# Altium schematic sheet ProtoAccélérotronLLLetMAS_Circuit.SchDoc
size Tabloid; Date: Date; Author: Author 1; Revision: 1; SheetNumber: 3; SheetTotal: 3; Size: 11x17; Sheet_Name: Circuit
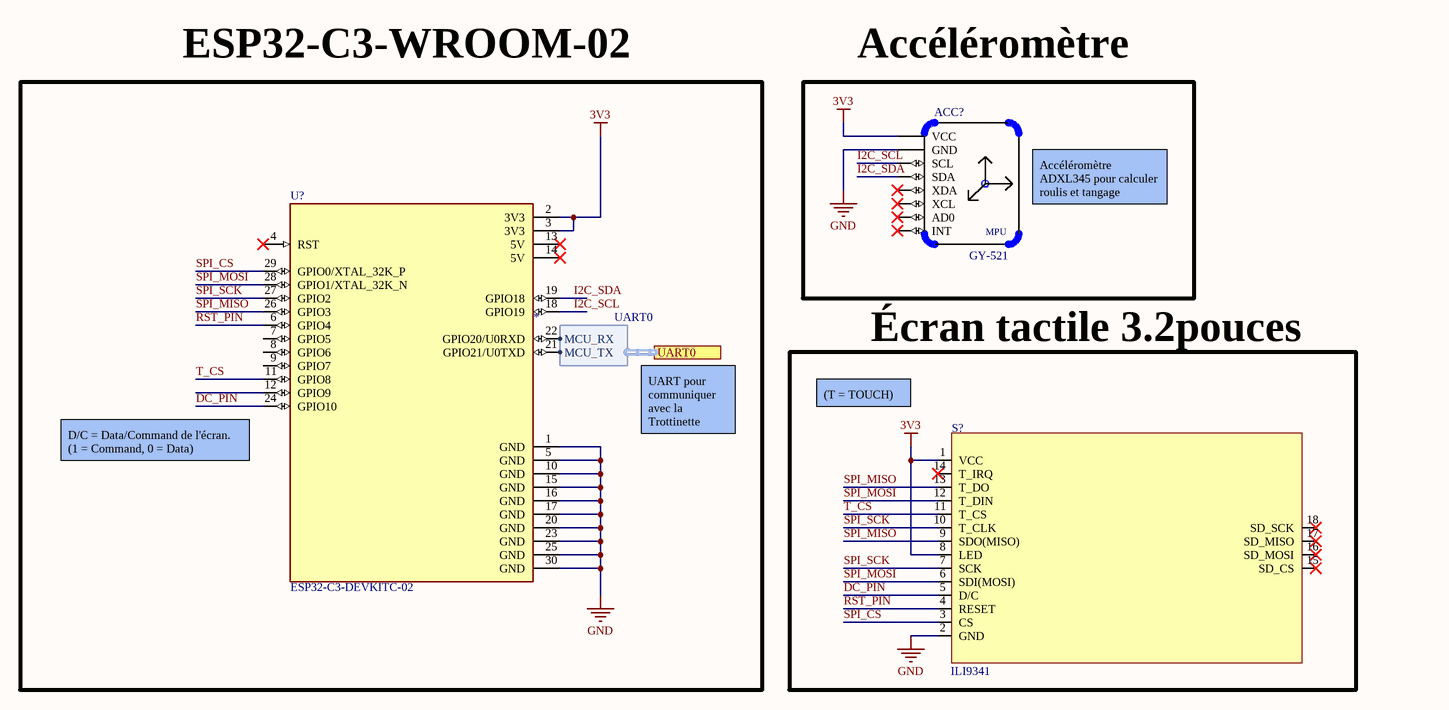
[diagram p0: ProtoAccélérotronLLLetMAS_Circuit.SchDoc]

## Parts
ACC?  GY-521  [*GY-521_GY-521(Primary)]
S?  ILI9341
U?  ESP32-C3-DEVKITC-02  [XCVR_ESP32-C3-DEVKITC-02]

## Blocks framed on the sheet
ESP32-C3-WROOM-02: U?
Accéléromètre: ACC?
Écran tactile 3.2pouces: S?

## Ports
UART0 (harness *)

## Harnesses
*: MCU_RX, MCU_TX

## Nets
3V3: ACC?.VCC S?.1(VCC) S?.8(LED) U?.2(3V3) U?.3(3V3)
GND: ACC?.GND S?.2(GND) U?.1(GND) U?.5(GND) U?.10(GND) U?.15(GND) U?.16(GND) U?.17(GND) U?.20(GND) U?.23(GND) U?.25(GND) U?.30(GND)
DC_PIN: S?.5(D/C) U?.24(GPIO10)
I2C_SCL: ACC?.SCL U?.18(GPIO19)
I2C_SDA: ACC?.SDA U?.19(GPIO18)
RST_PIN: S?.4(RESET) U?.6(GPIO4)
SPI_CS: S?.3(CS) U?.29(GPIO0/XTAL_32K_P)
SPI_MISO: S?.9(SDO(MISO)) S?.13(T_DO) U?.26(GPIO3)
SPI_MOSI: S?.6(SDI(MOSI)) S?.12(T_DIN) U?.28(GPIO1/XTAL_32K_N)
SPI_SCK: S?.7(SCK) S?.10(T_CLK) U?.27(GPIO2)
T_CS: S?.11(T_CS) U?.11(GPIO8)
NetU?_21: U?.21(GPIO21/U0TXD) ; port UART0.MCU_TX
NetU?_22: U?.22(GPIO20/U0RXD) ; port UART0.MCU_RX

Not connected (* = marked no-connect by the designer): ACC? AD0* INT* XCL* XDA*; S? 14(T_IRQ)* 15(SD_CS)* 16(SD_MOSI)* 17(SD_MISO)* 18(SD_SCK)*; U? 4(RST)* 7(GPIO5) 8(GPIO6) 9(GPIO7) 12(GPIO9) 13(5V)* 14(5V)*

## Notes on the sheet
- Accéléromètre ADXL345 pour calculer roulis et tangage
- UART0
- (near U?) D/C = Data/Command de l'écran.   (1 = Command, 0 = Data)
- UART pour communiquer avec la Trottinette
- (T = TOUCH)
- Nom de la feuille
- Titre du projet
- Cours associé au projet
- Taille
- Département
- Technologies du
- Révision
- PCB
- .
- SCH
- Date
- génie électrique
- Feuille
- Variant
- de
- Concepteurs
- (in symbol GY-521) MPU

## Library data of the parts
ACC? = GY-521: Triple Axis Accelerometer Gyro Breakout; MF: GODREAM FORDREAM CO., LIMITED; SnapEDA_Link: https://www.snapeda.com/parts/GY-521/GODREAM+FORDREAM+CO.%252C+LIMITED/view-part/?ref=snap; Package: Package; MP: GY-521; Check_prices: https://www.snapeda.com/parts/GY-521/GODREAM+FORDREAM+CO.%252C+LIMITED/view-part/?ref=eda; Value: *
S? = ILI9341: 3.2" 240x320 TFT LCD ILI9341; GRAMS Lib Spec: 3.2; Magnetic Material: UNKNOWN; Cryo: UNKNOWN; Solder Paste Type: UNKNOWN; Stencil Thickness (Recommended): UNKNOWN
U? = ESP32-C3-DEVKITC-02: Development Boards & Kits - Wireless (Engineering Samples) ESP32-C3 General-Purpose Development Board, embeds ESP32-C3-WROOM-02, 4 MB Flash, with Pin Header; MF: Espressif Systems; Purchase-URL: https://pricing.snapeda.com/search/part/ESP32-C3-DevKitC-02/?ref=eda; Package: None; MP: ESP32-C3-DevKitC-02; Value: *; Price: None; Availability: In Stock; SnapEDA_Link: https://www.snapeda.com/parts/ESP32-C3-DevKitC-02/Espressif+Systems/view-part/?ref=snap; Check_prices: https://www.snapeda.com/parts/ESP32-C3-DevKitC-02/Espressif+Systems/view-part/?ref=eda